# EAGLE board ASuitable Number Of Microphones (EAGLE 7.7.0), part 1 of 2
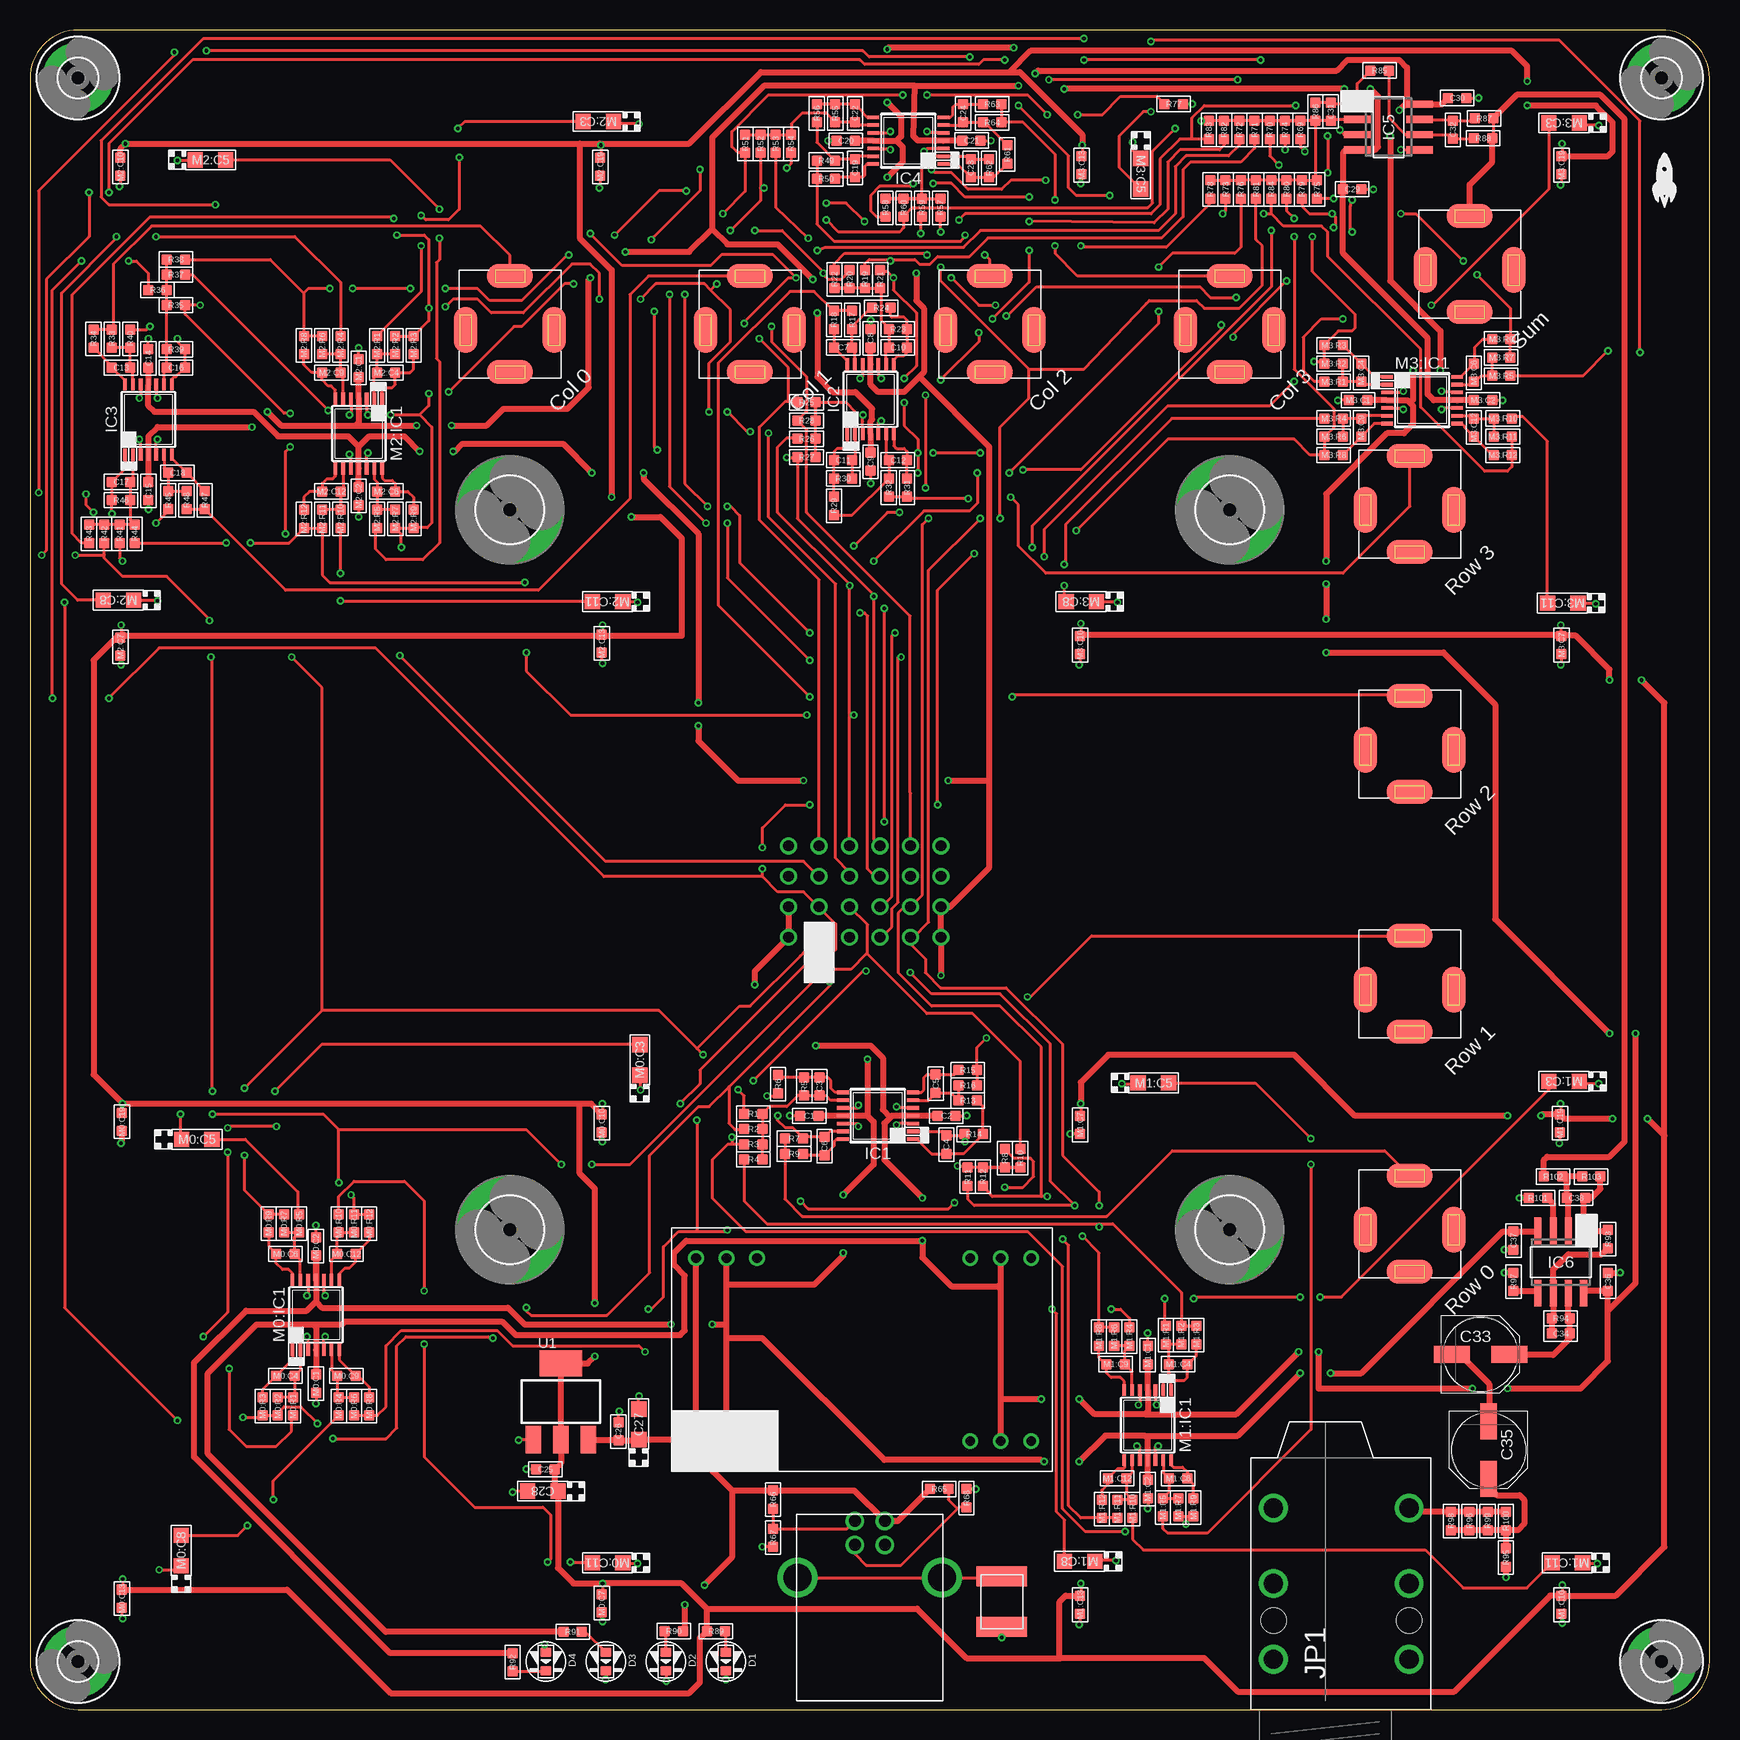
[diagram p3: board, top side]
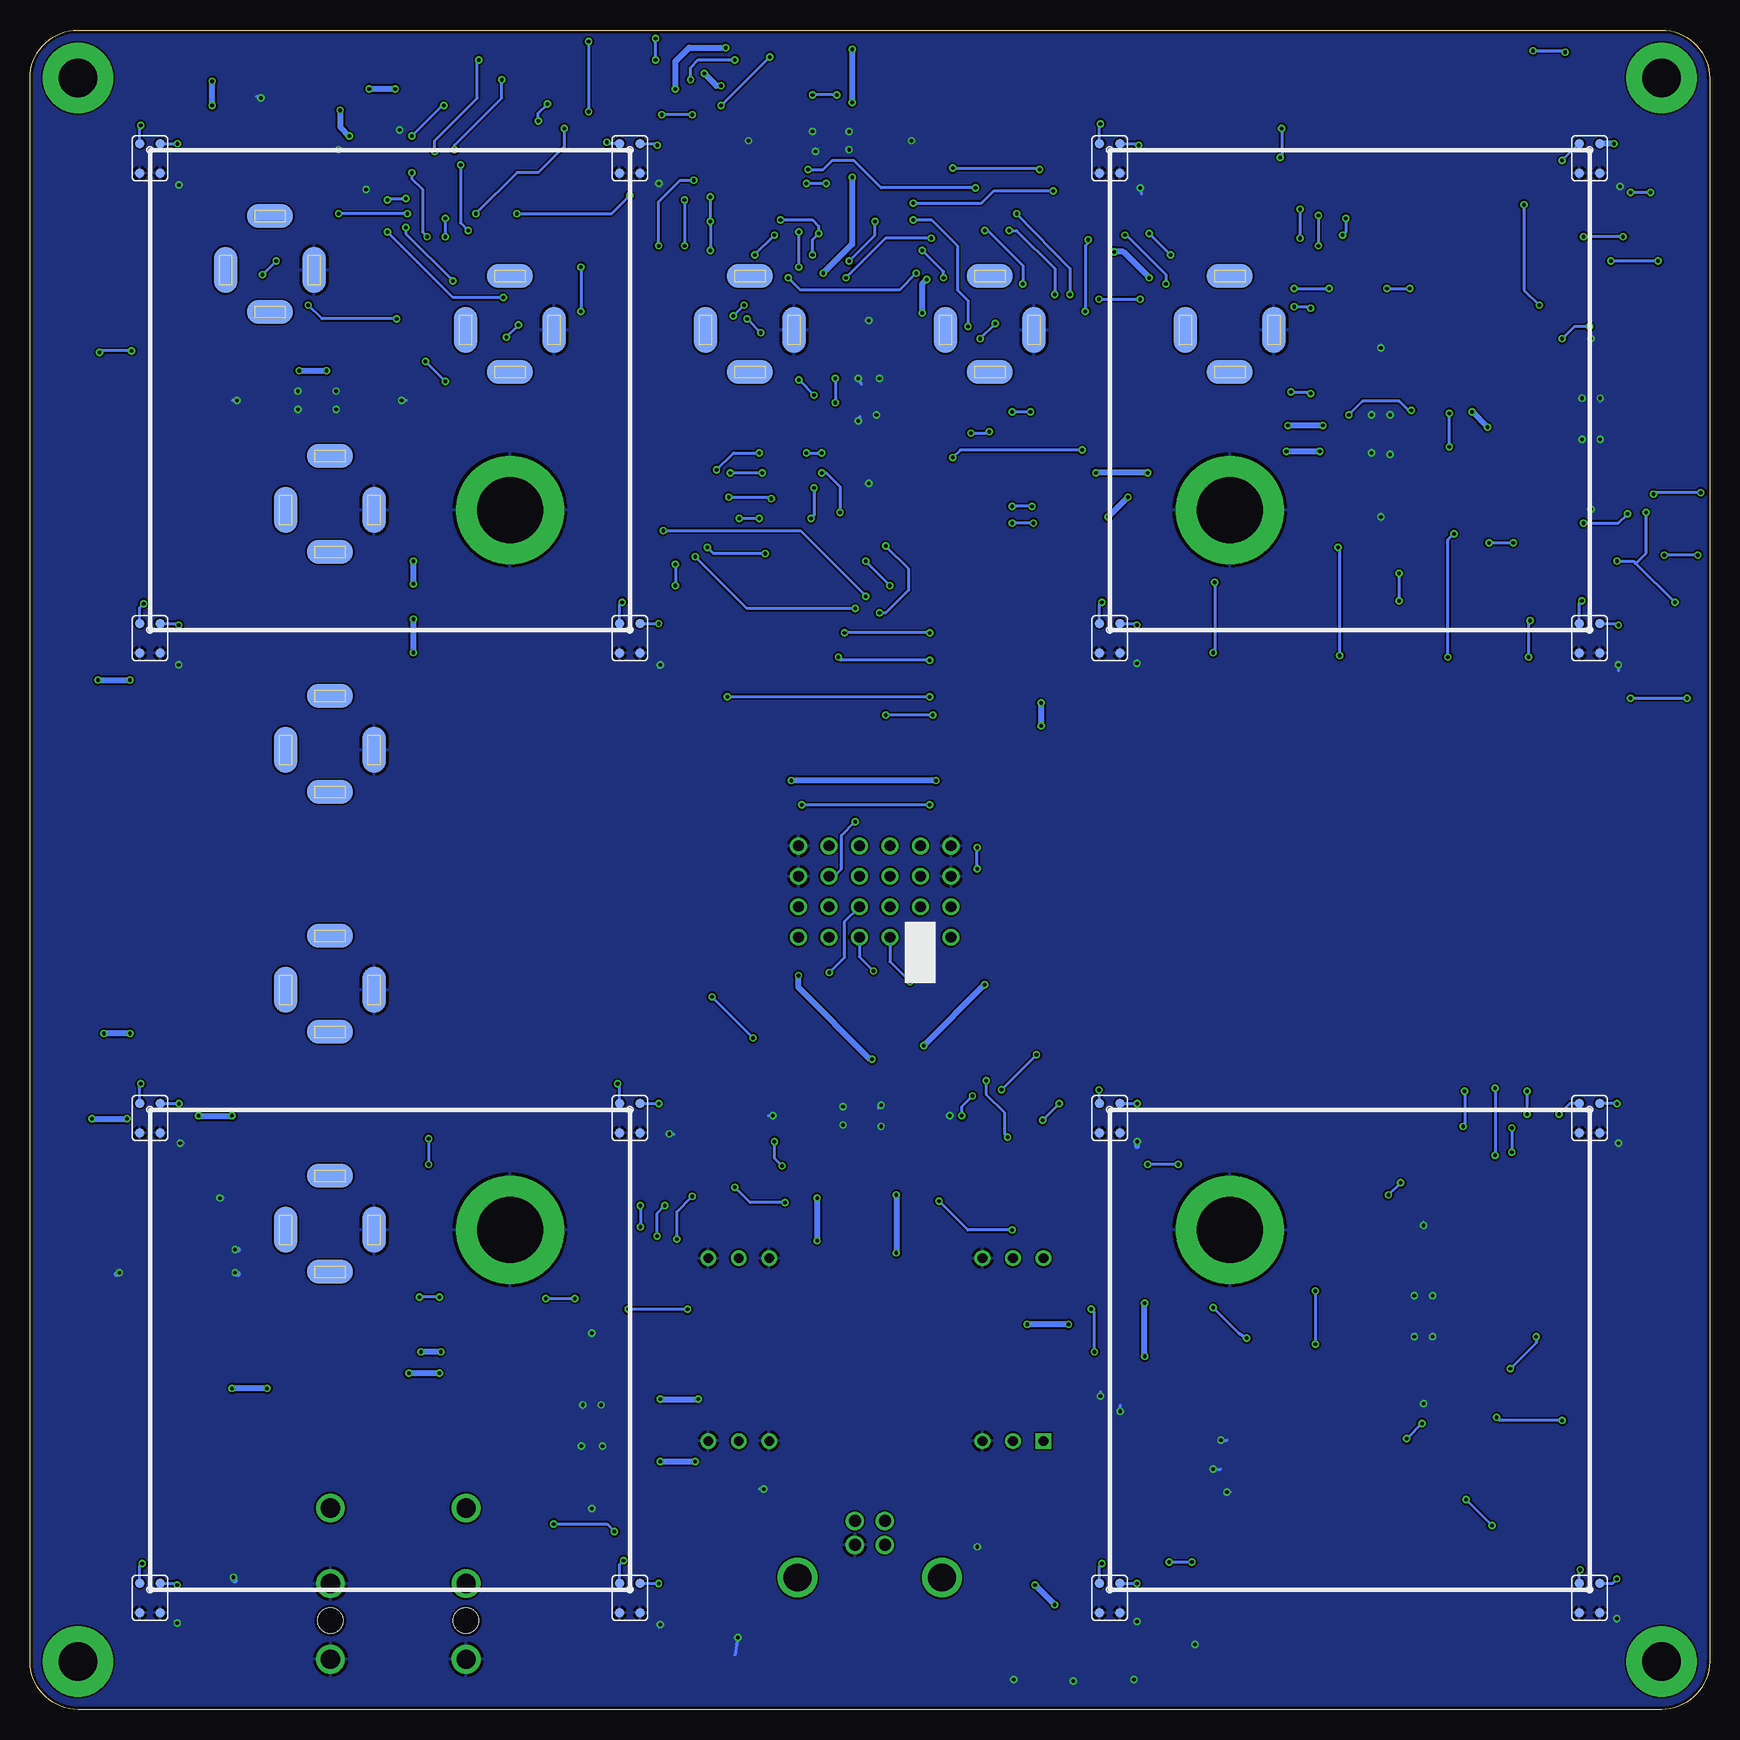
[diagram p4: board, bottom side, seen from below]

Size 140 x 140 mm. Coordinates in mm from the lower left corner, seen from the top.
Outline: 0,136 0,4 arc90 4,0 136,0 arc90 140,4 140,136 arc90 136,140 4,140 arc90 0,136
Copper layers (1*16): Top 0.035mm / dielectric 1.5mm / Bottom 0.035mm
Design rules "dirt_cheap_dirty_boards.v1.1": minimum track width 6mil, minimum drill 12mil, track to track 6mil, track to pad 6mil, pad to pad 6mil, via to via 6mil, smd to smd 0mil, copper to edge 10mil, drill to drill 10mil, minimum pad ring 10mil, minimum via ring 6mil, stop-mask expansion 2mil, vias tented up to drill 25mil, thermal gap 10mil
Net classes: 0 default: width 0.254 mm; 1 pwr: width 0.508 mm

## Footprints (pad centres in the part's own frame; a part is rotated, then mirrored left to right if it is on the bottom)
C0603 = smd 0.889 x 0.889: 1 -0.762,0; 2 0.762,0
CASE-A_3216 = smd 1.27 x 1.27: + -1.27,0; - 1.27,0
PANASONIC_D = smd 3 x 1.4: + 2.4,0; - -2.4,0
LED0603 = smd 0.762 x 0.889: + -0.762,0; - 0.762,0
5,5-PAD = drill 5.5 pad 9: B5,5 0,0
3,2-PAD = drill 3.2 pad 5.842: B3,2 0,0
TSSOP14 = smd 0.305 x 0.991: 1 -1.95,-2.918; 2 -1.3,-2.918; 3 -0.65,-2.918; 4 0,-2.918; 5 0.65,-2.918; 6 1.3,-2.918; 7 1.95,-2.918; 8 1.95,2.918; 9 1.3,2.918; 10 0.65,2.918; 11 0,2.918; 12 -0.65,2.918; 13 -1.3,2.918; 14 -1.95,2.918
SO08 = smd 0.6 x 2.2: 1 -1.905,-2.6; 2 -0.635,-2.6; 3 0.635,-2.6; 4 1.905,-2.6; 5 1.905,2.6; 6 0.635,2.6; 7 -0.635,2.6; 8 -1.905,2.6
3.5MM-JACK-SWITCH-13MM-NOHOLES = smd 1.95 x 3.85 bottom: RING_B@1 -3.7,0; SWITCH_B@1 3.7,0 | smd 1.95 x 3.85: RING_T@3 -3.7,0; SWITCH_T@3 3.7,0 | smd 3.85 x 1.95 bottom: SECOND_B@1 0,-3.5; TIP_B@1 0,4.5 | smd 3.85 x 1.95: SECOND_T@3 0,-3.5; TIP_T@3 0,4.5
AUDIO-JACK-.25-INCH-HORIZ-PTH = drill 1.6: P$2 4.2,-6.95; P$3 4.2,4.35; P$4 10.5,-6.95; P$5 10.5,4.35; P$6 16.8,-6.95; P$7 16.8,4.35 | hole 2.1: 7.4,4.35; 7.4,-6.95
FERRITE_1812 = smd 1.665 x 4.22: P$1 -2.118,0; P$2 2.118,0
SPU0410HR5H-PB = smd 0.8 x 0.8: P$1 0.85,1.23; P$2 0.85,-1.23; P$3 -0.85,-1.23; P$4 -0.85,1.23
R0603 = smd 0.889 x 0.889: 1 -0.762,0; 2 0.762,0
SOT223 = smd 1.27 x 2.286: 1 -2.286,-3.175; 2 0,-3.175; 3 2.286,-3.175 | smd 3.556 x 2.159: TER 0,3.175
TOOMANYMICROPHONES = drill 0.9: +12@1 -6.35,-3.81; +12@2 -6.35,-1.27; -12@1 6.35,-3.81; -12@2 6.35,-1.27; GND@1 -6.35,1.27; GND@2 -6.35,3.81; GND@3 6.35,1.27; GND@4 6.35,3.81; P$2 -1.27,-3.81; P$3 1.27,-3.81; P$4 3.81,-3.81; P$5 -3.81,-1.27; P$6 -1.27,-1.27; P$7 1.27,-1.27; P$8 3.81,-1.27; P$9 -3.81,1.27; P$10 -1.27,1.27; P$11 1.27,1.27; P$12 3.81,1.27; P$13 -3.81,3.81; P$14 -1.27,3.81; P$15 1.27,3.81; P$16 3.81,3.81 | drill 0.9 square: P$1 -3.81,-3.81
CINCONBRICK = drill 0.8 square: 1 -7.62,14.478 | drill 0.8: 2 -7.62,11.938; 3 -7.62,9.398; 10 -7.62,-8.382; 11 -7.62,-10.922; 12 -7.62,-13.462; 13 7.62,-13.462; 14 7.62,-10.922; 15 7.62,-8.382; 22 7.62,9.398; 23 7.62,11.938; 24 7.62,14.478
FCI61729 = drill 1: 1 1.25,4.71; 2 -1.25,4.71; 3 -1.25,2.71; 4 1.25,2.71 | drill 2.3: P$1 -6.02,0; P$2 6.02,0

## Placement (x,y rotation side)
C1  100n  [C0603]  64.96,49.49 0 top
C2  100n  [C0603]  76.39,49.49 0 top
C3  3.3n  [C0603]  65.81,51.94 90 top
C4  3.3n  [C0603]  76.39,47.08 270 top
C5  3.3n  [C0603]  75.5,52.16 270 top
C6  3.3n  [C0603]  66.23,46.95 90 top
C7  3.3n  [C0603]  67.78,113.54 0 top
C8  100n  [C0603]  70.06,114.3 270 top
C9  100n  [C0603]  70.06,104.01 270 top
C10  3.3n  [C0603]  72.35,113.54 0 top
C11  3.3n  [C0603]  67.78,104.14 180 top
C12  3.3n  [C0603]  72.35,104.14 180 top
C13  3.3n  [C0603]  7.59,111.85 0 top
C14  100n  [C0603]  9.87,112.62 270 top
C15  100n  [C0603]  9.87,101.57 270 top
C16  3.3n  [C0603]  12.16,111.85 0 top
C17  3.3n  [C0603]  7.59,102.33 180 top
C18  3.3n  [C0603]  12.29,103.09 180 top
C19  3.3n  [C0603]  68.77,128.48 90 top
C20  100n  [C0603]  68.01,130.77 0 top
C21  100n  [C0603]  78.49,130.78 0 top
C22  3.3n  [C0603]  68.77,133.06 90 top
C23  3.3n  [C0603]  78.42,128.48 270 top
C24  3.3n  [C0603]  77.78,133.06 270 top
C25  100n  [C0603]  42.96,20.01 180 top
C26  100n  [C0603]  49.04,23.19 90 top
C27  10u  [CASE-A_3216]  50.74,23.78 90 top
C28  10u  [CASE-A_3216]  42.75,18.2 180 top
C29  100n  [C0603]  110.22,126.73 180 top
C30  100n  [C0603]  118.97,134.33 0 top
C31  3.3n  [C0603]  108.42,133.19 90 top
C32  3.3n  [C0603]  118.61,131.68 270 top
C33  100u  [PANASONIC_D]  120.92,29.61 0 top
C34  22p  [C0603]  127.6,31.34 0 top
C35  100u  [PANASONIC_D]  121.58,21.63 270 top
C36  100n  [C0603]  131.54,35.65 270 top
C37  100n  [C0603]  123.67,39.08 270 top
C38  22p  [C0603]  128.87,42.64 0 top
D1  [LED0603]  58,4 270 top
D2  [LED0603]  53,4 270 top
D3  [LED0603]  48,4 270 top
D4  [LED0603]  43,4 270 top
H1  MOUNT-PAD-ROUND5.5  [5,5-PAD]  40,100 0 top
H2  MOUNT-PAD-ROUND5.5  [5,5-PAD]  100,40 0 top
H3  MOUNT-PAD-ROUND5.5  [5,5-PAD]  40,40 0 top
H4  MOUNT-PAD-ROUND5.5  [5,5-PAD]  100,100 0 top
H5  MOUNT-PAD-ROUND3.2  [3,2-PAD]  4,4 0 top
H6  MOUNT-PAD-ROUND3.2  [3,2-PAD]  136,4 0 top
H7  MOUNT-PAD-ROUND3.2  [3,2-PAD]  4,136 0 top
H8  MOUNT-PAD-ROUND3.2  [3,2-PAD]  136,136 0 top
IC1  TL074TSSOP14  [TSSOP14]  70.67,49.49 90 top
IC2  TL074TSSOP14  [TSSOP14]  70.06,109.22 0 top
IC3  TL074TSSOP14  [TSSOP14]  9.87,107.54 0 top
IC4  TL074TSSOP14  [TSSOP14]  73.21,130.77 90 top
IC5  TL072  [SO08]  113.24,131.9 270 top
IC6  NE5532D  [SO08]  127.6,37.3 180 top
J1  JACK  [3.5MM-JACK-SWITCH-13MM-NOHOLES]  115,60 0 top
J2  JACK  [3.5MM-JACK-SWITCH-13MM-NOHOLES]  115,80 0 top
J3  JACK  [3.5MM-JACK-SWITCH-13MM-NOHOLES]  115,100 0 top
J4  JACK  [3.5MM-JACK-SWITCH-13MM-NOHOLES]  40,115 0 top
J5  JACK  [3.5MM-JACK-SWITCH-13MM-NOHOLES]  60,115 0 top
J6  JACK  [3.5MM-JACK-SWITCH-13MM-NOHOLES]  80,115 0 top
J7  JACK  [3.5MM-JACK-SWITCH-13MM-NOHOLES]  100,115 0 top
J8  JACK  [3.5MM-JACK-SWITCH-13MM-NOHOLES]  120,120 0 top
J19  JACK  [3.5MM-JACK-SWITCH-13MM-NOHOLES]  115,40 0 top
JP1  [AUDIO-JACK-.25-INCH-HORIZ-PTH]  108,0 90 top
L1  FERRITE_1812  [FERRITE_1812]  81,9 90 top
M0:C1  100n  [C0603]  23.84,27.18 90 top
M0:C2  100n  [C0603]  23.84,38.61 90 top
M0:C3  1u  [CASE-A_3216]  50.83,54.15 90 top
M0:C4  3.3n  [C0603]  21.3,27.81 0 top
M0:C5  1u  [CASE-A_3216]  13.9,47.52 0 top
M0:C6  3.3n  [C0603]  21.3,37.97 0 top
M0:C7  100n  [C0603]  47.67,8.86 90 top
M0:C8  1u  [CASE-A_3216]  12.6,13.25 90 top
M0:C9  3.3n  [C0603]  26.38,27.81 180 top
M0:C10  100n  [C0603]  47.67,48.86 90 top
M0:C11  1u  [CASE-A_3216]  48.14,12.22 180 top
M0:C12  3.3n  [C0603]  26.38,37.97 180 top
M0:C13  100n  [C0603]  7.67,9.24 90 top
M0:C19  100n  [C0603]  7.67,48.98 90 top
M0:IC1  TL074TSSOP14  [TSSOP14]  23.84,32.89 0 top
M0:MIC0  SPU0410HR5H-PB  [SPU0410HR5H-PB]  10,49.3 0 bottom
M0:MIC1  SPU0410HR5H-PB  [SPU0410HR5H-PB]  50,49.3 0 bottom
M0:MIC2  SPU0410HR5H-PB  [SPU0410HR5H-PB]  10,9.3 0 bottom
M0:MIC3  SPU0410HR5H-PB  [SPU0410HR5H-PB]  50,9.3 0 bottom
M0:R1  100  [R0603]  21.93,25.27 90 top
M0:R2  100k  [R0603]  20.66,25.27 270 top
M0:R3  100  [R0603]  19.39,25.27 270 top
M0:R4  100  [R0603]  25.74,25.27 90 top
M0:R5  100  [R0603]  22.44,40.51 270 top
M0:R6  100k  [R0603]  27.01,25.27 270 top
M0:R7  100k  [R0603]  21.17,40.51 90 top
M0:R8  100  [R0603]  28.28,25.27 270 top
M0:R9  100  [R0603]  19.9,40.51 90 top
M0:R10  100  [R0603]  25.74,40.51 270 top
M0:R11  100k  [R0603]  27.01,40.51 90 top
M0:R12  100  [R0603]  28.28,40.51 90 top
M1:C1  100n  [C0603]  93.17,29.55 270 top
M1:C2  100n  [C0603]  93.17,18.38 270 top
M1:C3  1u  [CASE-A_3216]  127.88,52.36 180 top
M1:C4  3.3n  [C0603]  95.71,28.79 180 top
M1:C5  1u  [CASE-A_3216]  93.65,52.22 0 top
M1:C6  3.3n  [C0603]  95.71,19.27 180 top
M1:C7  100n  [C0603]  87.54,48.73 90 top
M1:C8  1u  [CASE-A_3216]  87.51,12.35 180 top
M1:C9  3.3n  [C0603]  90.5,28.79 0 top
M1:C10  100n  [C0603]  127.67,8.73 90 top
M1:C11  1u  [CASE-A_3216]  128.14,12.22 180 top
M1:C12  3.3n  [C0603]  90.63,19.27 0 top
M1:C13  100n  [C0603]  87.54,8.73 90 top
M1:C19  100n  [C0603]  127.54,48.86 90 top
M1:IC1  TL074TSSOP14  [TSSOP14]  93.17,23.71 180 top
M1:MIC0  SPU0410HR5H-PB  [SPU0410HR5H-PB]  90,49.3 0 bottom
M1:MIC1  SPU0410HR5H-PB  [SPU0410HR5H-PB]  130,49.3 0 bottom
M1:MIC2  SPU0410HR5H-PB  [SPU0410HR5H-PB]  90,9.3 0 bottom
M1:MIC3  SPU0410HR5H-PB  [SPU0410HR5H-PB]  130,9.3 0 bottom
M1:R1  100  [R0603]  94.69,31.2 270 top
M1:R2  100k  [R0603]  95.96,31.2 90 top
M1:R3  100  [R0603]  97.23,31.2 90 top
M1:R4  100  [R0603]  91.64,31.08 270 top
M1:R5  100  [R0603]  94.44,16.85 90 top
M1:R6  100k  [R0603]  90.38,31.08 90 top
M1:R7  100k  [R0603]  95.71,16.85 270 top
M1:R8  100  [R0603]  89.11,31.08 90 top
M1:R9  100  [R0603]  96.98,16.85 270 top
M1:R10  100  [R0603]  91.9,16.73 90 top
M1:R11  100k  [R0603]  90.63,16.73 270 top
M1:R12  100  [R0603]  89.36,16.73 270 top
M2:C1  100n  [C0603]  27.41,111.82 270 top
M2:C2  100n  [C0603]  27.41,101.15 270 top
M2:C3  1u  [CASE-A_3216]  47.38,132.37 180 top
M2:C4  3.3n  [C0603]  29.69,111.44 180 top
M2:C5  1u  [CASE-A_3216]  15.05,129.17 0 top
M2:C6  3.3n  [C0603]  29.69,101.53 180 top
M2:C7  100n  [C0603]  7.54,88.6 90 top
M2:C8  1u  [CASE-A_3216]  7.38,92.48 180 top
M2:C9  3.3n  [C0603]  25.12,111.44 0 top
M2:C10  100n  [C0603]  7.54,128.6 90 top
M2:C11  1u  [CASE-A_3216]  48.14,92.35 180 top
M2:C12  3.3n  [C0603]  25.12,101.53 0 top
M2:C13  100n  [C0603]  47.67,88.86 90 top
M2:C19  100n  [C0603]  47.54,128.6 90 top
M2:IC1  TL074TSSOP14  [TSSOP14]  27.41,106.36 180 top
M2:MIC0  SPU0410HR5H-PB  [SPU0410HR5H-PB]  10,129.3 0 bottom
M2:MIC1  SPU0410HR5H-PB  [SPU0410HR5H-PB]  50,129.3 0 bottom
M2:MIC2  SPU0410HR5H-PB  [SPU0410HR5H-PB]  10,89.3 0 bottom
M2:MIC3  SPU0410HR5H-PB  [SPU0410HR5H-PB]  50,89.3 0 bottom
M2:R1  100  [R0603]  28.93,113.73 270 top
M2:R2  100k  [R0603]  30.45,113.73 90 top
M2:R3  100  [R0603]  31.98,113.73 90 top
M2:R4  100  [R0603]  25.88,113.73 270 top
M2:R5  100  [R0603]  28.93,99.25 90 top
M2:R6  100k  [R0603]  24.36,113.73 90 top
M2:R7  100k  [R0603]  30.45,99.25 270 top
M2:R8  100  [R0603]  22.83,113.73 90 top
M2:R9  100  [R0603]  31.98,99.25 270 top
M2:R10  100  [R0603]  25.88,99.25 90 top
M2:R11  100k  [R0603]  24.36,99.25 270 top
M2:R12  100  [R0603]  22.83,99.25 270 top
M3:C1  100n  [C0603]  110.71,109.14 0 top
M3:C2  100n  [C0603]  121.12,109.14 0 top
M3:C3  1u  [CASE-A_3216]  127.88,132.25 180 top
M3:C4  3.3n  [C0603]  110.96,111.43 270 top
M3:C5  1u  [CASE-A_3216]  92.59,128.01 270 top
M3:C6  3.3n  [C0603]  120.36,111.43 270 top
M3:C7  100n  [C0603]  127.67,88.73 90 top
M3:C8  1u  [CASE-A_3216]  87.64,92.35 180 top
M3:C9  3.3n  [C0603]  110.96,106.86 90 top
M3:C10  100n  [C0603]  87.54,88.73 90 top
M3:C11  1u  [CASE-A_3216]  127.76,92.22 180 top
M3:C12  3.3n  [C0603]  120.36,106.86 90 top
M3:C13  100n  [C0603]  87.67,128.73 90 top
M3:C19  100n  [C0603]  127.67,128.73 90 top
M3:IC1  TL074TSSOP14  [TSSOP14]  116.04,109.14 270 top
M3:MIC0  SPU0410HR5H-PB  [SPU0410HR5H-PB]  90,129.3 0 bottom
M3:MIC1  SPU0410HR5H-PB  [SPU0410HR5H-PB]  130,129.3 0 bottom
M3:MIC2  SPU0410HR5H-PB  [SPU0410HR5H-PB]  90,89.3 0 bottom
M3:MIC3  SPU0410HR5H-PB  [SPU0410HR5H-PB]  130,89.3 0 bottom
M3:R1  100  [R0603]  108.67,110.67 0 top
M3:R2  100k  [R0603]  108.67,112.19 180 top
M3:R3  100  [R0603]  108.67,113.72 180 top
M3:R4  100  [R0603]  108.67,107.62 0 top
M3:R5  100  [R0603]  122.64,111.17 180 top
M3:R6  100k  [R0603]  108.67,106.09 180 top
M3:R7  100k  [R0603]  122.64,112.7 0 top
M3:R8  100  [R0603]  108.67,104.57 180 top
M3:R9  100  [R0603]  122.64,114.22 0 top
M3:R10  100  [R0603]  122.77,107.62 180 top
M3:R11  100k  [R0603]  122.77,106.09 0 top
M3:R12  100  [R0603]  122.77,104.57 0 top
R1  100k  [R0603]  60.28,49.66 0 top
R2  100k  [R0603]  60.28,48.39 0 top
R3  100k  [R0603]  60.28,47.12 0 top
R4  100k  [R0603]  60.28,45.85 0 top
R5  100k  [R0603]  64.53,51.94 90 top
R6  100k  [R0603]  62.36,52.13 270 top
R7  100k  [R0603]  63.69,47.59 180 top
R8  100k  [R0603]  81.26,45.95 270 top
R9  100  [R0603]  63.69,46.31 180 top
R10  100k  [R0603]  82.55,45.95 270 top
R11  100k  [R0603]  78.17,44.41 90 top
R12  100k  [R0603]  79.44,44.41 90 top
R13  100k  [R0603]  78.17,50.76 180 top
R14  100k  [R0603]  78.67,47.97 0 top
R15  100  [R0603]  78.17,53.3 0 top
R16  100k  [R0603]  78.17,52.03 0 top
R17  100k  [R0603]  68.54,115.82 90 top
R18  100  [R0603]  67.02,115.82 90 top
R19  100k  [R0603]  69.6,119.23 270 top
R20  100k  [R0603]  68.33,119.23 270 top
R21  100k  [R0603]  70.87,119.23 270 top
R22  100k  [R0603]  67.06,119.23 270 top
R23  100k  [R0603]  72.35,115.06 0 top
R24  100k  [R0603]  70.95,116.84 180 top
R25  100k  [R0603]  64.73,108.97 0 top
R26  100k  [R0603]  64.73,105.92 0 top
R27  100k  [R0603]  64.73,104.39 0 top
R28  100k  [R0603]  64.73,107.44 0 top
R29  100k  [R0603]  67.02,100.33 270 top
R30  100k  [R0603]  67.78,102.62 180 top
R31  100  [R0603]  73.11,101.85 270 top
R32  100k  [R0603]  71.59,101.85 270 top
R33  100k  [R0603]  6.83,114.27 90 top
R34  100  [R0603]  5.3,114.27 90 top
R35  100k  [R0603]  12.16,117.06 180 top
R36  100k  [R0603]  10.63,118.33 0 top
R37  100k  [R0603]  12.16,119.6 180 top
R38  100k  [R0603]  12.16,120.87 180 top
R39  100k  [R0603]  12.16,113.38 0 top
R40  100k  [R0603]  8.35,114.27 270 top
R41  100k  [R0603]  7.46,98.01 90 top
R42  100k  [R0603]  6.19,98.01 90 top
R43  100k  [R0603]  4.92,98.01 90 top
R44  100k  [R0603]  8.73,98.01 90 top
R45  100k  [R0603]  11.52,100.81 90 top
R46  100k  [R0603]  7.59,100.81 180 top
R47  100  [R0603]  14.57,100.81 270 top
R48  100k  [R0603]  13.05,100.81 270 top
R49  100k  [R0603]  66.35,129.12 180 top
R50  100  [R0603]  66.35,127.59 180 top
R51  100k  [R0603]  59.62,130.52 90 top
R52  100k  [R0603]  60.89,130.52 90 top
R53  100k  [R0603]  62.16,130.52 90 top
R54  100k  [R0603]  63.43,130.52 90 top
R55  100k  [R0603]  67.12,133.06 90 top
R56  100k  [R0603]  65.59,133.06 270 top
R57  100k  [R0603]  75.88,125.18 90 top
R58  100k  [R0603]  71.31,125.18 90 top
R59  100k  [R0603]  74.36,125.18 90 top
R60  100k  [R0603]  72.83,125.18 90 top
R61  100k  [R0603]  81.47,129.63 90 top
R62  100k  [R0603]  79.94,128.48 270 top
R63  100  [R0603]  80.2,133.82 0 top
R64  100k  [R0603]  80.2,132.29 0 top
R65  75k  [R0603]  75.79,18.38 180 top
R66  75k  [R0603]  61.94,17.49 90 top
R67  49.9k  [R0603]  61.94,14.32 90 top
R68  49.9k  [R0603]  78.07,17.62 270 top
R69  100k  [R0603]  105.89,131.67 90 top
R70  100k  [R0603]  103.34,131.67 90 top
R71  100k  [R0603]  102.08,131.67 90 top
R72  100k  [R0603]  100.81,131.67 90 top
R73  100k  [R0603]  99.66,126.71 90 top
R74  100k  [R0603]  104.61,131.67 90 top
R75  100k  [R0603]  107.28,126.71 90 top
R76  100k  [R0603]  100.93,126.71 90 top
R77  100k  [R0603]  95.34,133.82 0 top
R78  100k  [R0603]  98.39,126.71 90 top
R79  100k  [R0603]  106.01,126.71 90 top
R80  100k  [R0603]  104.74,126.71 90 top
R81  100k  [R0603]  102.2,126.71 90 top
R82  100k  [R0603]  99.53,131.67 90 top
R83  100k  [R0603]  98.27,131.67 90 top
R84  100k  [R0603]  103.47,126.71 90 top
R85  100k  [R0603]  112.49,136.62 0 top
R86  100k  [R0603]  107.16,133.19 90 top
R87  100  [R0603]  121.2,132.63 0 top
R88  100k  [R0603]  121.12,130.97 0 top
R89  68  [R0603]  57.18,6.53 180 top
R90  150  [R0603]  53.66,6.54 0 top
R91  560  [R0603]  45.23,6.47 180 top
R92  560  [R0603]  40.23,3.94 270 top
R93  4.7k  [R0603]  131.54,39.21 90 top
R94  4.7k  [R0603]  127.6,32.61 180 top
R95  56k  [R0603]  123.03,12.67 270 top
R96  220  [R0603]  119.98,15.71 90 top
R97  27  [R0603]  123.67,35.65 90 top
R98  220  [R0603]  118.46,15.71 90 top
R99  220  [R0603]  121.51,15.71 90 top
R100  220  [R0603]  123.03,15.71 90 top
R101  27  [R0603]  125.7,42.64 180 top
R102  4.7k  [R0603]  126.97,44.42 180 top
R103  4.7k  [R0603]  130.14,44.42 180 top
U1  CJ1117-3.3-1310190P1  [SOT223]  44.25,25.67 0 top
U$29  TOOMANYMICROPHONES  [TOOMANYMICROPHONES]  69.59,68.19 0 top
U$42  CINCONBRICK_12V  [CINCONBRICK]  70,30 90 top
U$51  TINRS_ARTWORKTINYDATE  [JUSTATINYROCKET_DATECODE]  136.24,127.47 0 top
X1  USB-B-FEMALE  [FCI61729]  70,11 0 top